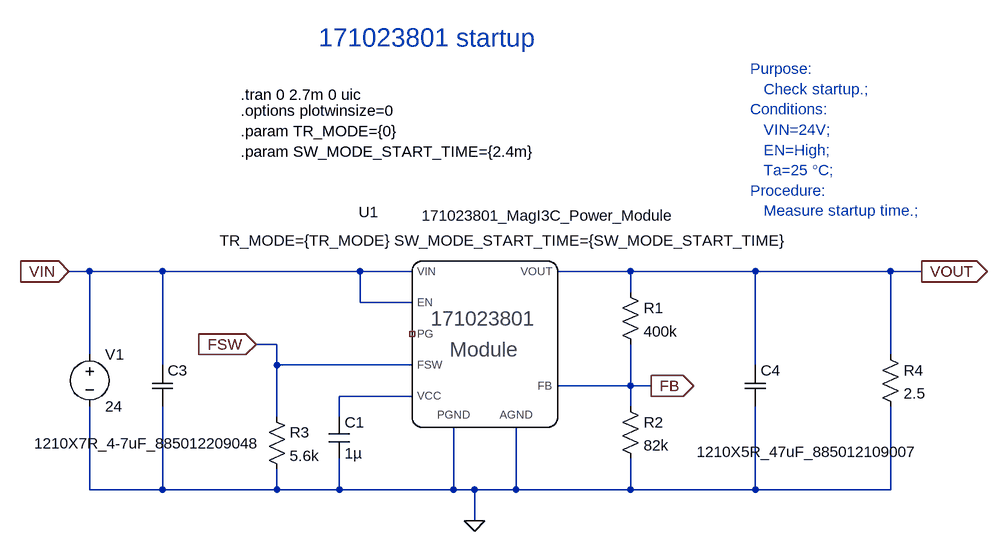
[diagram p0: schematic 171023801 startup.asc]
171023801 startup.asc, the LTspice schematic file:
Version 4
SHEET 1 2056 680
WIRE -384 48 -416 48
WIRE -272 48 -384 48
WIRE 32 48 -272 48
WIRE 112 48 32 48
WIRE 448 48 336 48
WIRE 640 48 448 48
WIRE 848 48 640 48
WIRE 896 48 848 48
WIRE 448 80 448 48
WIRE 32 96 32 48
WIRE 112 96 32 96
WIRE -96 160 -128 160
WIRE -384 176 -384 48
WIRE 848 176 848 48
WIRE -272 192 -272 48
WIRE -96 192 -96 160
WIRE 112 192 -96 192
WIRE 640 192 640 48
WIRE 448 224 448 160
WIRE 448 224 336 224
WIRE 480 224 448 224
WIRE 112 240 0 240
WIRE 448 256 448 224
WIRE -96 272 -96 192
WIRE 0 272 0 240
WIRE -384 384 -384 256
WIRE -272 384 -272 256
WIRE -272 384 -384 384
WIRE -96 384 -96 352
WIRE -96 384 -272 384
WIRE 0 384 0 336
WIRE 0 384 -96 384
WIRE 176 384 176 288
WIRE 176 384 0 384
WIRE 208 384 176 384
WIRE 272 384 272 288
WIRE 272 384 208 384
WIRE 448 384 448 336
WIRE 448 384 272 384
WIRE 640 384 640 256
WIRE 640 384 448 384
WIRE 848 384 848 256
WIRE 848 384 640 384
WIRE 208 432 208 384
FLAG 208 432 0
FLAG -416 48 VIN
IOPIN -416 48 In
FLAG 896 48 VOUT
IOPIN 896 48 Out
FLAG 480 224 FB
IOPIN 480 224 Out
FLAG -128 160 FSW
IOPIN -128 160 In
SYMBOL res 432 64 R0
SYMATTR InstName R1
SYMATTR Value 400k
SYMBOL res 432 240 R0
SYMATTR InstName R2
SYMATTR Value 82k
SYMBOL res -112 256 R0
SYMATTR InstName R3
SYMATTR Value 5.6k
SYMBOL cap -16 272 R0
SYMATTR InstName C1
SYMATTR Value 1µ
SYMATTR SpiceLine Rser=7.13m Lser=257p
SYMBOL voltage -384 160 R0
WINDOW 123 0 0 Left 0
WINDOW 39 0 0 Left 0
SYMATTR InstName V1
SYMATTR Value 24
SYMBOL res 832 160 R0
SYMATTR InstName R4
SYMATTR Value 2.5
SYMBOL WCAP-CSGP_10V_DCbias 624 192 R0
WINDOW 38 -74 134 Left 2
SYMATTR SpiceModel 1210X5R_47uF_885012109007
SYMATTR InstName C4
SYMBOL WCAP-CSGP_50V_DCbias -288 192 R0
WINDOW 38 -181 121 Left 2
SYMATTR SpiceModel 1210X7R_4-7uF_885012209048
SYMATTR InstName C3
SYMBOL 171023801_MagI3C_Power_Module 256 64 R0
SYMATTR InstName U1
TEXT -32 -312 Left 4 ;171023801 startup
TEXT 632 -264 Left 2 ;Purpose: \n   Check startup.; \nConditions: \n   VIN=24V; \n   EN=High; \n   Ta=25 °C; \nProcedure: \n   Measure startup time.;
TEXT -152 -224 Left 2 !.tran 0 2.7m 0 uic
TEXT -152 -200 Left 2 !.options plotwinsize=0
TEXT -152 -168 Left 2 !.param TR_MODE={0}\n.param SW_MODE_START_TIME={2.4m}

The netlist it stands for:
* 171023801 startup.asc
R1 VOUT FB 400k
R2 FB 0 82k
R3 FSW 0 5.6k
C1 N001 0 1µ Rser=7.13m Lser=257p
V1 VIN 0 24
R4 VOUT 0 2.5
XC4 VOUT 0 1210X5R_47uF_885012109007  ; pins A B
XC3 VIN 0 1210X7R_4-7uF_885012209048  ; pins A B
XU1 VOUT FB VIN VIN NC_01 FSW N001 0 0 171023801_MagI3C_Power_Module TR_MODE={TR_MODE} SW_MODE_START_TIME={SW_MODE_START_TIME}  ; pins VOUT FB VIN EN PG FSW VCC PGND AGND
* 171023801 startup
* Purpose:
*    Check startup.;
* Conditions:
*    VIN=24V;
*    EN=High;
*    Ta=25 °C;
* Procedure:
*    Measure startup time.;
.tran 0 2.7m 0 uic
.options plotwinsize=0
.param TR_MODE={0}
.param SW_MODE_START_TIME={2.4m}
.lib WCAP-CSGP_10V_DCbias.lib
.lib WCAP-CSGP_50V_DCbias.lib
.lib 171023801.lib
.backanno
.end